# EasyEDA Pro project FPV_GROUND_STATION_SOURCE_FILE_PCB.epro

# Schematic Schematic1

## Sheets
1 POWER_BLK: Board Name: Board1; Create Date: 2026-05-17; Page Name: POWER_BLK; Project Name: JulyMonitor_uHAT; Schematic Name: Schematic1; Update Date: 2026-05-17; Company: EasyEDA.com; Page Size: A4; Version: V1.0
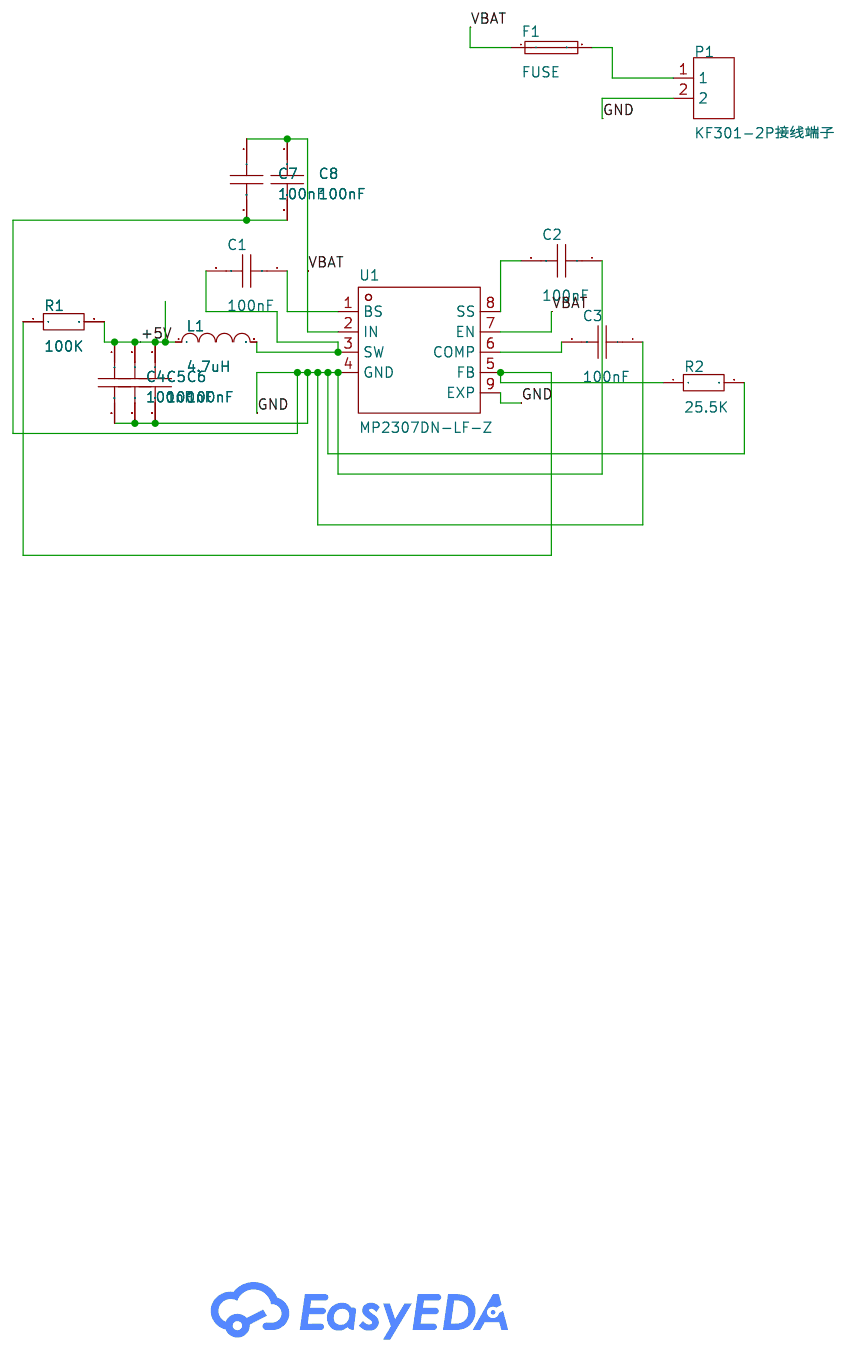
[diagram p0: POWER_BLK]
2 GPIO header + USB-A: Page Name: GPIO header + USB-A
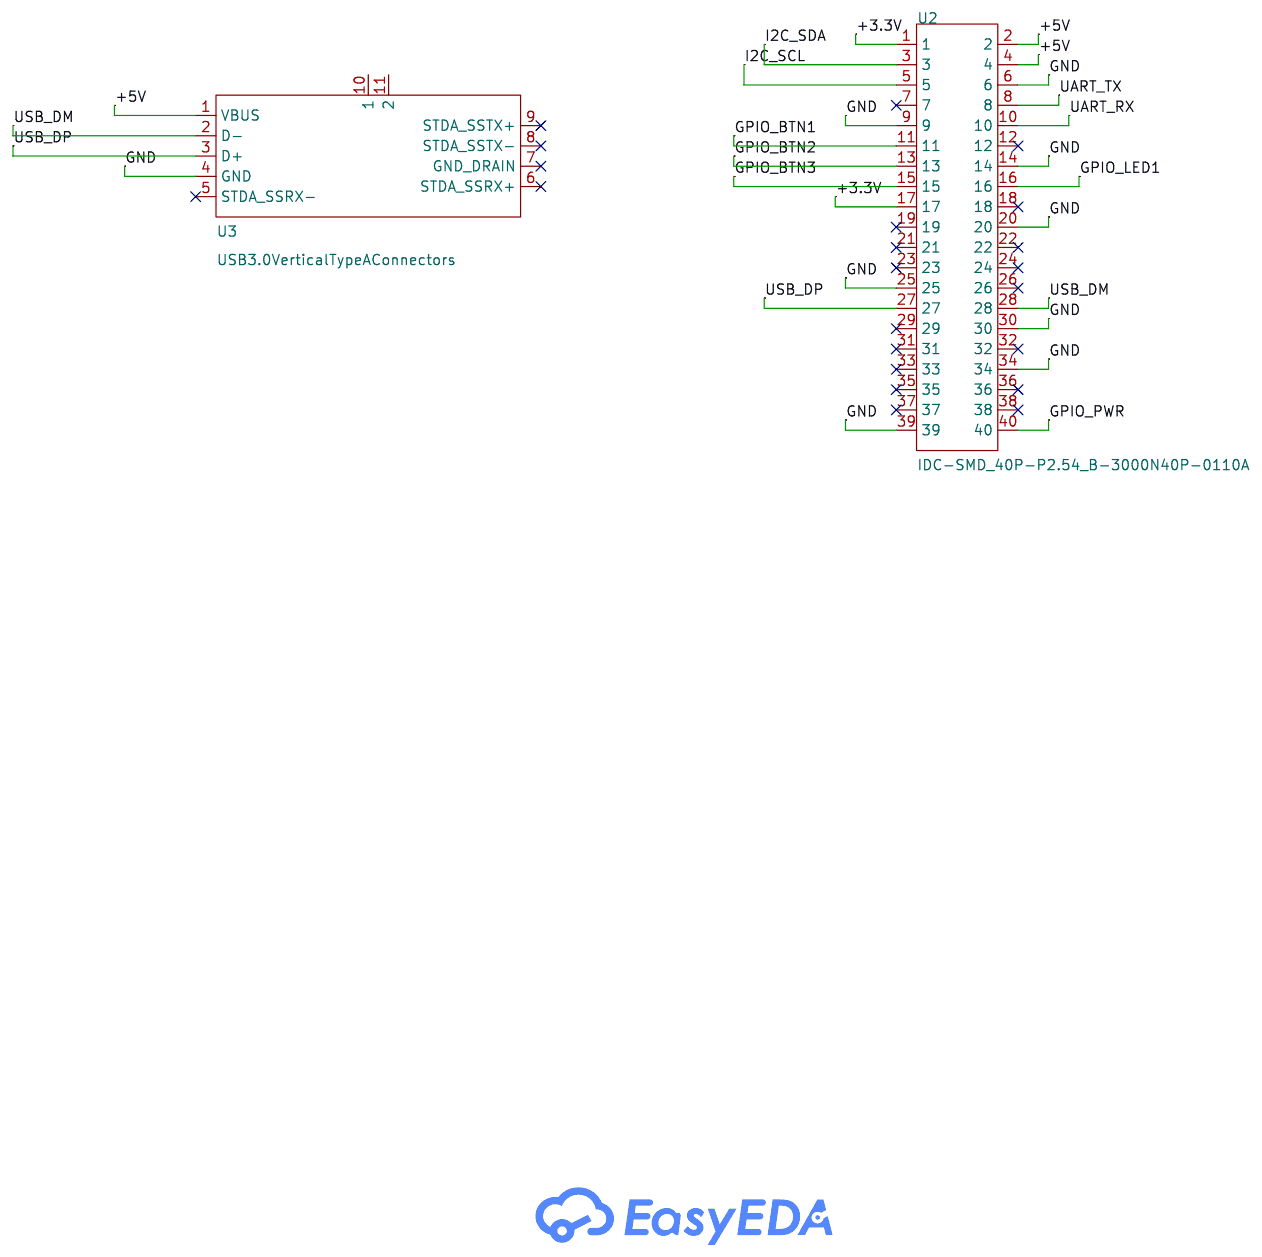
[diagram p1: GPIO header + USB-A]
3 LEDS AND OLED DISP: Page Name: LEDS AND OLED DISP
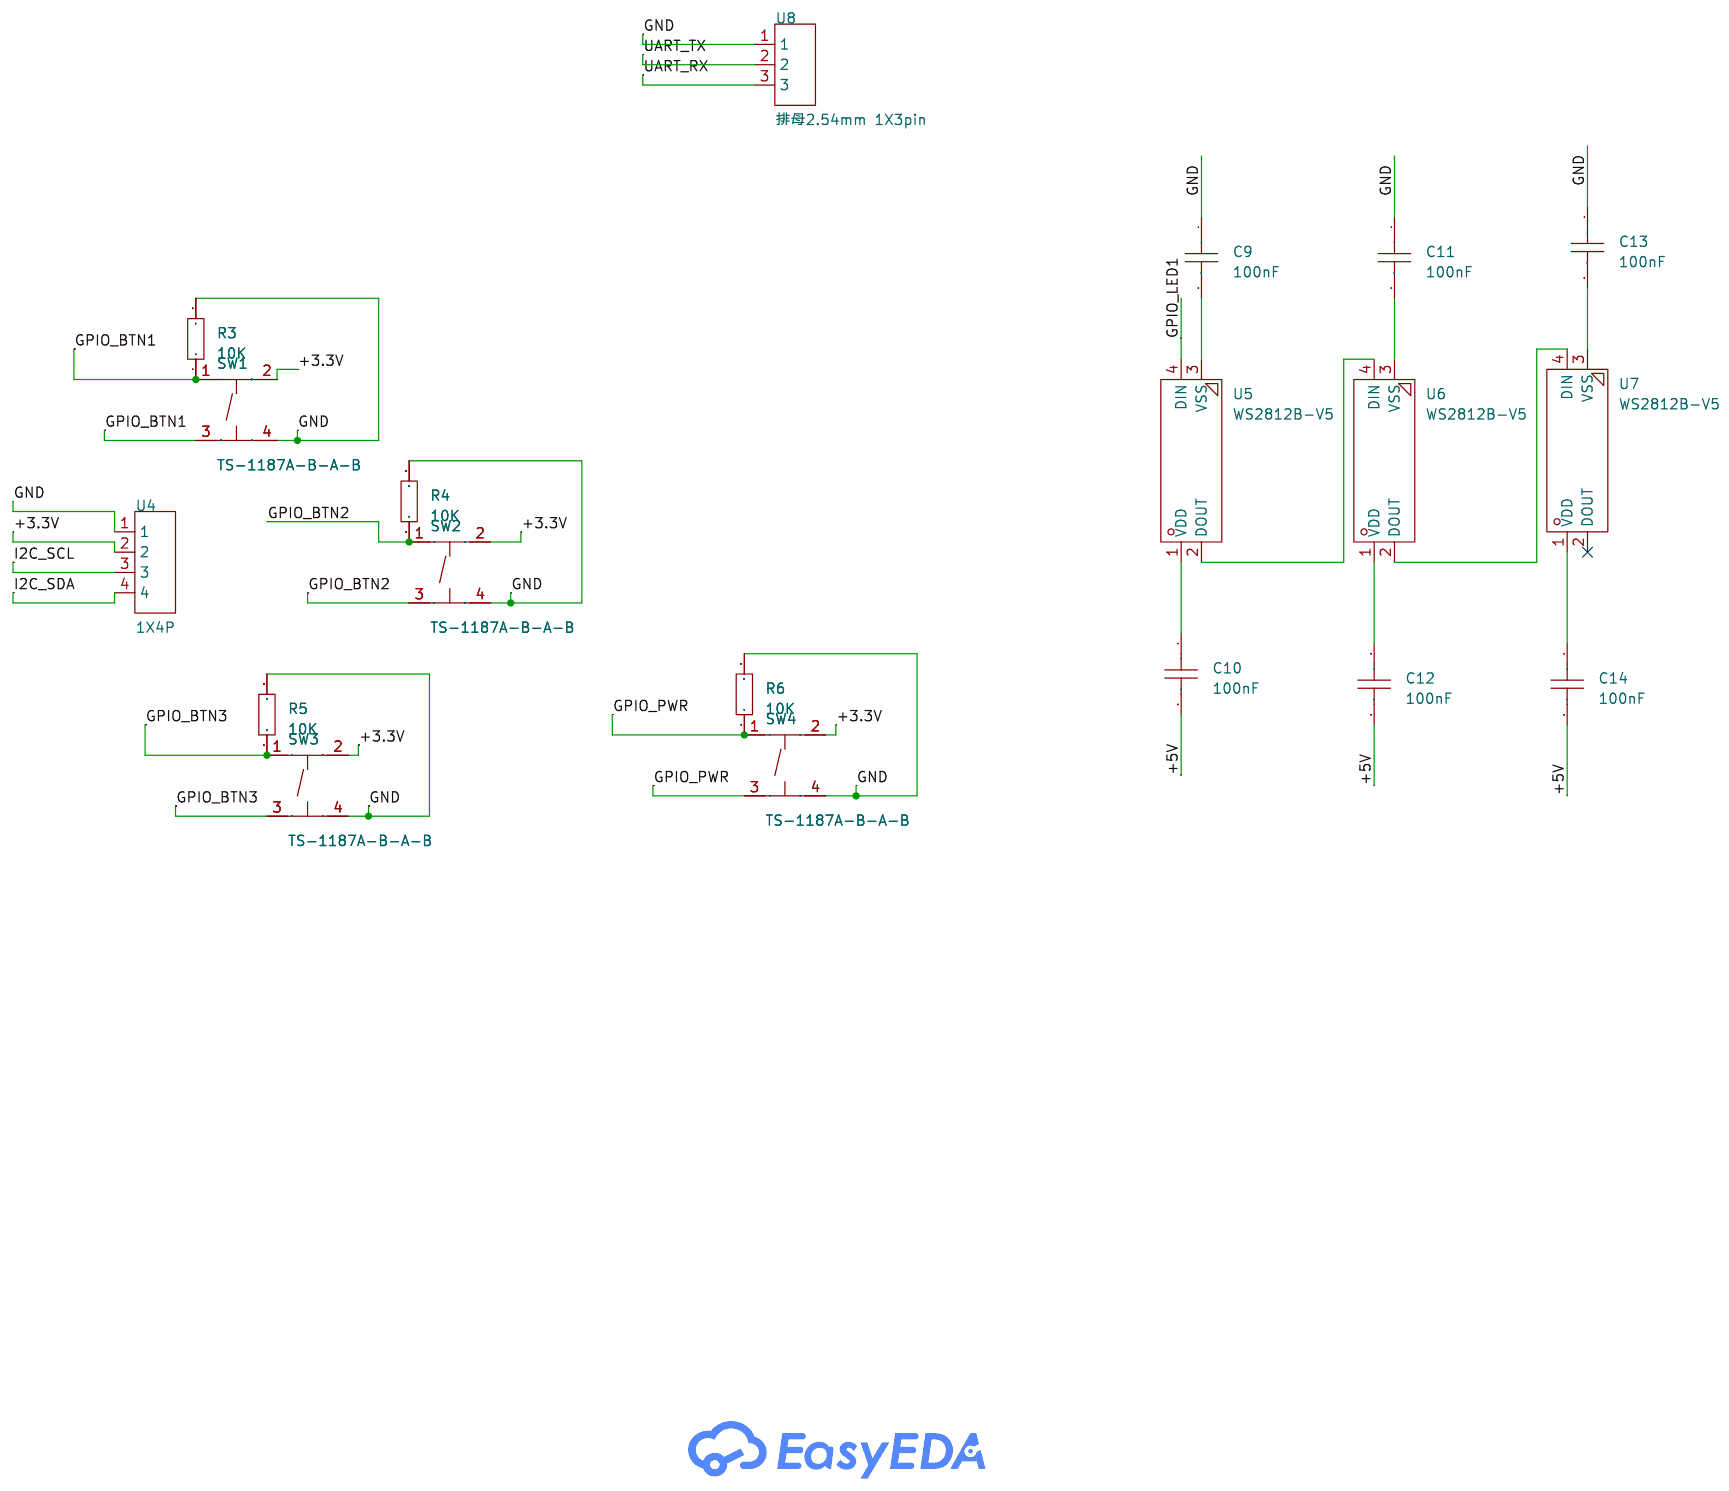
[diagram p2: LEDS AND OLED DISP]

## Parts
sheet GPIO header + USB-A
U2  IDC-SMD_40P-P2.54_B-3000N40P-0110A  [HDR-SMD_40P-P2.54-V-F-R2-C20-LS7.9]
U3  USB3.0VerticalTypeAConnectors  [USB-A-TH_C9900010398]
sheet LEDS AND OLED DISP
C9  100nF  [C0603]
C10  100nF  [C0603]
C11  100nF  [C0603]
C12  100nF  [C0603]
C13  100nF  [C0603]
C14  100nF  [C0603]
R3  10K  [R0603]
R4  10K  [R0603]
R5  10K  [R0603]
R6  10K  [R0603]
SW1  TS-1187A-B-A-B  [SW-SMD_4P-L5.1-W5.1-P3.70-LS6.5-TL_H1.5]
SW2  TS-1187A-B-A-B  [SW-SMD_4P-L5.1-W5.1-P3.70-LS6.5-TL_H1.5]
SW3  TS-1187A-B-A-B  [SW-SMD_4P-L5.1-W5.1-P3.70-LS6.5-TL_H1.5]
SW4  TS-1187A-B-A-B  [SW-SMD_4P-L5.1-W5.1-P3.70-LS6.5-TL_H1.5]
U4  1X4P  [CONN-TH_4P-P2.54_C9900022166]
U5  WS2812B-V5  [LED-SMD_4P-L5.0-W5.0-TL_WS2812B-B]
U6  WS2812B-V5  [LED-SMD_4P-L5.0-W5.0-TL_WS2812B-B]
U7  WS2812B-V5  [LED-SMD_4P-L5.0-W5.0-TL_WS2812B-B]
U8  排母2.54mm 1X3pin  [HDR-TH_3P-P2.54_CS-1165SDIG]
sheet POWER_BLK
C1  100nF  [C0603]
C2  100nF  [C0603]
C3  100nF  [C0603]
C4  100nF  [C0603]
C5  100nF  [C0603]
C6  100nF  [C0603]
C7  100nF  [C0603]
C8  100nF  [C0603]
F1  FUSE  [F1206]
L1  4.7uH  [L0603]
P1  KF301-2P接线端子  [CONN-TH_XY301V-A-5.0-2P]
R1  100K  [R0603]
R2  25.5K  [R0603]
U1  MP2307DN-LF-Z  [SOP-8_L4.9-W3.9-P1.27-LS6.0-BL-EP]

## Library data of the parts
U2 = IDC-SMD_40P-P2.54_B-3000N40P-0110A: Supplier Part: C9900016611; Supplier Footprint: 2.54mm2x20P; JLCPCB Part Class: Extended Part; Supplier: LCSC
U3 = USB3.0VerticalTypeAConnectors: Supplier Part: C9900010398; Supplier Footprint: USB3.0VerticalTypeA; JLCPCB Part Class: Extended Part; Supplier: LCSC
C1-C14 = CAP_0603: Supplier Footprint: 0603
R1-R6 = Res_0603: Supplier Footprint: 0603
SW1-SW4 = TS-1187A-B-A-B: Circuit:SPST Actuator Style:Round Button Operating Force:1.6N Mounting Type:Surface Mount,Vertical Length:5.1mm Width:5.1mm Switch Height:1.5mm with Bracket:Without Bracket Contact Current:50mA Voltage Rating:12V Actuator/Cap Color:Gold With Lamp:No Life:; LCSC Part Name: 5.1*5.1*1.5mm 立贴 轻触开关; Supplier Part: C318884; Manufacturer: XKB Connection(中国星坤); Supplier Footprint: SMD; JLCPCB Part Class: Basic Part; Datasheet: https://item.szlcsc.com/datasheet/TS-1187A-B-A-B/299976.html; Supplier: LCSC; Circuit: SPST; Actuator Style: Round Button; Operating Force: 1.6N; Mounting Type: Surface Mount,Vertical; Length: 5.1mm; Width: 5.1mm; Switch Height: 1.5mm; with Bracket: Without Bracket; Contact Current: 50mA; Voltage Rating: 12V; Actuator/Cap Color: Gold; With Lamp: No; Life: 100,000 Cycles; Operating Temperature: -30℃~+85℃
U4 = 1X4P: Supplier Part: C9900022166; Supplier Footprint: CONN-SMD-TH; JLCPCB Part Class: Extended Part; Supplier: LCSC
U5-U7 = WS2812B-V5: Supplier Part: C691873; Supplier Footprint: SMD,5x5mm; JLCPCB Part Class: Extended Part; Supplier: LCSC
U8 = 排母2.54mm 1X3pin: Supplier Part: C9900016709; JLCPCB Part Class: Extended Part; Supplier: LCSC
F1 = FUSE: Supplier Part: C9900021114; JLCPCB Part Class: Extended Part; Supplier: LCSC
L1 = L_0603
P1 = KF301-2P接线端子: Supplier Part: C9900016950; Supplier Footprint: CK301-2P; JLCPCB Part Class: Extended Part; Supplier: LCSC
U1 = MP2307DN-LF-Z: Function:Buck Voltage - Supply:4.75V~23V Voltage - Supply:4.75V~23V Output Voltage:925mV~20V Output Voltage:925mV~20V Output Current:3A Frequency - Switching:340kHz Frequency - Switching:340kHz Operating Temperature:-40℃~+85℃ Operating Temperature:-40℃~+8; LCSC Part Name: 3A，23V，340KHz同步整流降压转换器; Supplier Part: C18921; Manufacturer: MPS(芯源); Supplier Footprint: SOIC-8N-EP-150mil; JLCPCB Part Class: Extended Part; Datasheet: https://item.szlcsc.com/datasheet/MP2307DN-LF-Z/19624.html; Supplier: LCSC; Function: Buck; Voltage - Supply: 4.75V~23V; Output Voltage: 925mV~20V; Output Current: 3A; Frequency - Switching: 340kHz; Operating Temperature: -40℃~+85℃; Synchronous Rectifier: Yes; Number of Outputs: 1; Topology: Buck; Switch tube (built-in/external): Built-In; Output Type: Adjustable

## Nets
+3.3V: SW1.2(B) SW2.2(B) SW3.2(B) SW4.2(B) U2.1 U2.17 U4.2
+5V: C4.1 C5.1 C6.1 C10.2 C12.2 C14.2 L1.1 R1.2 U2.2 U2.4 U3.1(VBUS)
GND: C2.1 C3.1 C4.2 C5.2 C6.2 C7.2 C8.2 C9.1 C11.1 C13.1 P1.2 R2.2 R3.2 R4.2 R5.2 R6.2 SW1.4(D) SW2.4(D) SW3.4(D) SW4.4(D) U1.4(GND) U1.9(EXP) U2.6 U2.9 U2.14 U2.20 U2.25 U2.30 U2.34 U2.39 U3.4(GND) U4.1 U8.1
VBAT: C7.1 C8.1 F1.1 U1.2(IN) U1.7(EN)
GPIO_BTN1: R3.1 SW1.1(A) SW1.3(C) U2.11
GPIO_BTN2: R4.1 SW2.1(A) SW2.3(C) U2.13
GPIO_BTN3: R5.1 SW3.1(A) SW3.3(C) U2.15
GPIO_LED1: U2.16 U5.4(DIN)
GPIO_PWR: R6.1 SW4.1(A) SW4.3(C) U2.40
I2C_SCL: U2.5 U4.3
I2C_SDA: U2.3 U4.4
UART_RX: U2.10 U8.3
UART_TX: U2.8 U8.2
USB_DM: U2.28 U3.2(D-)
USB_DP: U2.27 U3.3(D+)
$1N198: F1.2 P1.1
$1N609: C1.2 L1.2 U1.3(SW)
$1N625: C1.1 U1.1(BS)
$1N643: C2.2 U1.8(SS)
$1N661: C3.2 U1.6(COMP)
$1N789: R1.1 R2.1 U1.5(FB)
$3N1279: C9.2 U5.3(VSS)
$3N1283: C11.2 U6.3(VSS)
$3N1287: C13.2 U7.3(VSS)
$3N1313: U5.2(DOUT) U6.4(DIN)
$3N1319: U6.2(DOUT) U7.4(DIN)
$3N1500: C10.1 U5.1(VDD)
$3N1509: C12.1 U6.1(VDD)
$3N1515: C14.1 U7.1(VDD)

Not connected (* = marked no-connect by the designer): U2 7* 12* 18* 19* 21* 22* 23* 24* 26* 29* 31* 32* 33* 35* 36* 37* 38*; U3 5(STDA_SSRX-)* 6(STDA_SSRX+)* 7(GND_DRAIN)* 8(STDA_SSTX-)* 9(STDA_SSTX+)* 10(1) 11(2); U7 2(DOUT)*

# Board PCB1
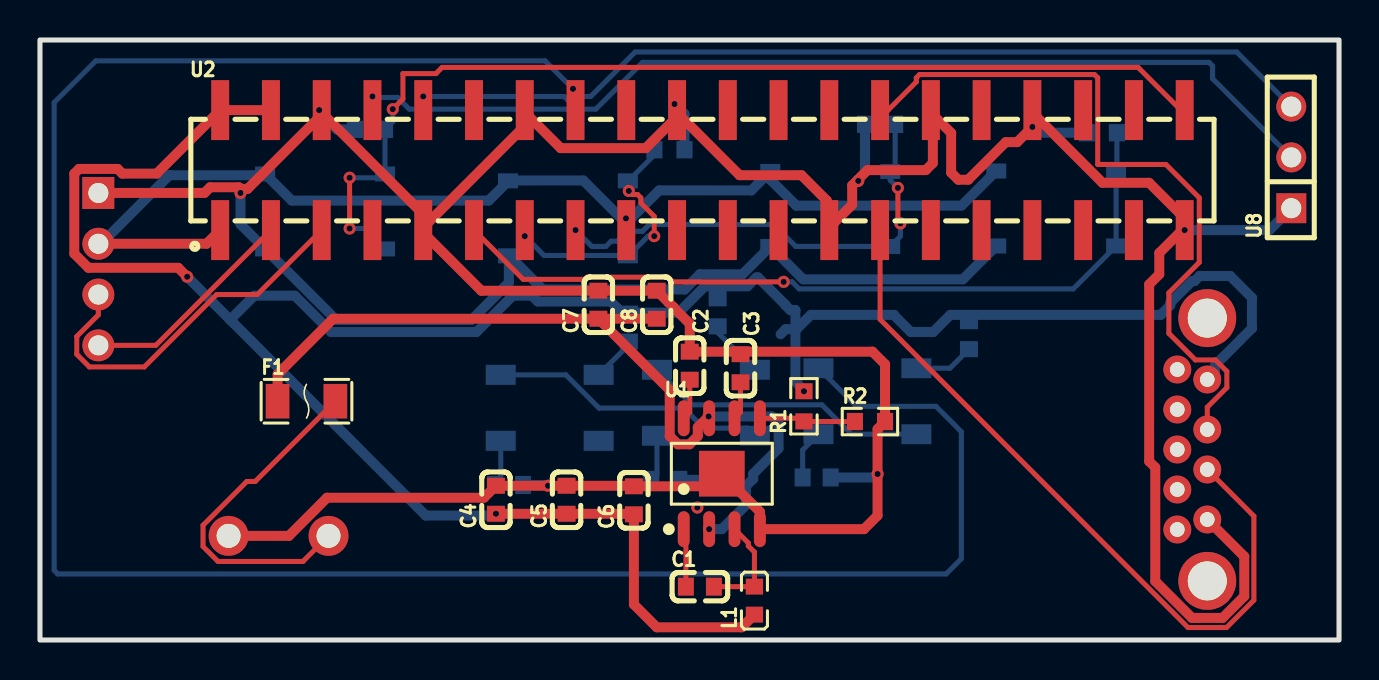
[diagram p3: board, top side]
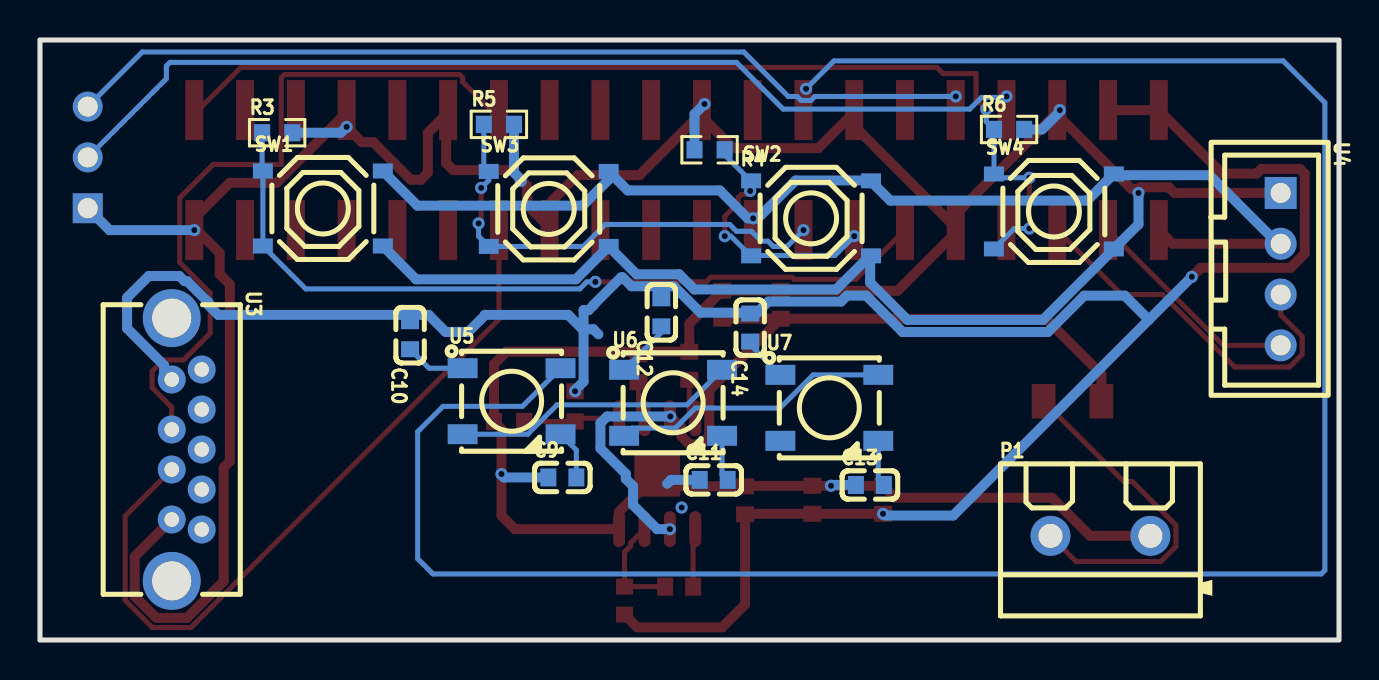
[diagram p4: board, bottom side, seen from below]

Outline 65 x 30 mm; copper layers: Top Layer, Bottom Layer. Coordinates in mm from the lower left corner of the outline.
Outline path: rectangle 0,30 65,0
Stack: Top Layer 0.035mm / Dielectric1 1.51mm FR4 er 4.5 / Bottom Layer 0.035mm

## Design rules (mm)
template: JLCPCB Capability(Two Layers Board)
spacing copperThickness1oz (default): track to track 0.102, other pairs 0.152 to 0.3
spacing copperThickness2oz: track to track 0.203, other pairs 0.152 to 0.3
track width copperThickness1oz (default): min 0.127, default 0.254, max 2.54
track width copperThickness2oz: min 0.203, default 0.254, max 2.54
differential pair differentialPair (default): width min 0.127, default 0.254, max 2.54; gap min 0.152, default 0.152
via viaSize (default): diameter min 0.5, default 0.61, max 10; hole min 0.3, default 0.305, max 6.3

## Placement (name value [footprint] x y rotation side)
C1  100nF  [C0603]  33.02 2.67 0 top
C2  100nF  [C0603]  32.51 13.72 270 top
C3  100nF  [C0603]  35.05 13.59 270 top
C4  100nF  [C0603]  22.82 7.01 90 top
C5  100nF  [C0603]  26.35 7.01 90 top
C6  100nF  [C0603]  29.72 6.98 90 top
C7  100nF  [C0603]  27.94 16.76 90 top
C8  100nF  [C0603]  30.86 16.76 90 top
C9  100nF  [C0603]  38.86 8.13 180 bottom
C10  100nF  [C0603]  46.48 15.24 90 bottom
C11  100nF  [C0603]  31.29 8.01 180 bottom
C12  100nF  [C0603]  33.91 16.38 90 bottom
C13  100nF  [C0603]  23.47 7.75 180 bottom
C14  100nF  [C0603]  29.46 15.62 90 bottom
F1  FUSE  [F1206]  13.33 11.94 0 top
L1  4.7uH  [L0603]  35.75 1.97 90 top
P1  KF301-2P接线端子  [CONN-TH_XY301V-A-5.0-2P]  11.94 5.21 180 bottom
R1  100K  [R0603]  38.23 11.68 90 top
R2  25.5K  [R0603]  41.53 10.92 0 top
R3  10K  [R0603]  53.13 25.36 180 bottom
R4  10K  [R0603]  31.5 24.51 0 bottom
R5  10K  [R0603]  42.04 25.78 180 bottom
R6  10K  [R0603]  16.51 25.53 180 bottom
SW1  TS-1187A-B-A-B  [SW-SMD_4P-L5.1-W5.1-P3.70-LS6.5-TL_H1.5]  50.85 21.58 180 bottom
SW2  TS-1187A-B-A-B  [SW-SMD_4P-L5.1-W5.1-P3.70-LS6.5-TL_H1.5]  26.42 21.08 180 bottom
SW3  TS-1187A-B-A-B  [SW-SMD_4P-L5.1-W5.1-P3.70-LS6.5-TL_H1.5]  39.54 21.55 180 bottom
SW4  TS-1187A-B-A-B  [SW-SMD_4P-L5.1-W5.1-P3.70-LS6.5-TL_H1.5]  14.27 21.43 180 bottom
U1  MP2307DN-LF-Z  [SOP-8_L4.9-W3.9-P1.27-LS6.0-BL-EP]  34.12 8.31 0 top
U2  IDC-SMD_40P-P2.54_B-3000N40P-0110A  [HDR-SMD_40P-P2.54-V-F-R2-C20-LS7.9]  33.15 23.49 0 top
U3  USB3.0VerticalTypeAConnectors  [USB-A-TH_C9900010398]  57.66 9.52 270 bottom
U4  1X4P  [CONN-TH_4P-P2.54_C9900022166]  2.92 18.54 270 bottom
U5  WS2812B-V5  [LED-SMD_4P-L5.0-W5.0-TL_WS2812B-B]  41.4 11.94 180 bottom
U6  WS2812B-V5  [LED-SMD_4P-L5.0-W5.0-TL_WS2812B-B]  33.32 11.86 180 bottom
U7  WS2812B-V5  [LED-SMD_4P-L5.0-W5.0-TL_WS2812B-B]  25.5 11.61 180 bottom
U8  排母2.54mm 1X3pin  [HDR-TH_3P-P2.54_CS-1165SDIG]  62.61 24.13 90 top

## Footprints (pads in the part's own frame, mm; a bottom-side part is the same pattern mirrored in y, then rotated)
C0603
  rect 0.8x0.9 smd: 1(-0.7,0) 2(0.7,0)
CONN-TH_4P-P2.54_C9900022166
  rect 1.6x1.6 hole 1: 1(-3.81,0)
  round 1.6 hole 1: 2(-1.27,0) 3(1.27,0) 4(3.81,0)
CONN-TH_XY301V-A-5.0-2P
  round 2 hole 1.2: 1(-2.5,0) 2(2.5,0)
F1206
  rect 1.19x1.728 smd: 1(-1.445,0) 2(1.445,0)
HDR-SMD_40P-P2.54-V-F-R2-C20-LS7.9
  rect 0.9x3 smd: 1(-24.13,-3) 2(-24.13,3) 3(-21.59,-3) 4(-21.59,3) 5(-19.05,-3) 6(-19.05,3) 7(-16.51,-3) 8(-16.51,3) 9(-13.97,-3) 10(-13.97,3) 11(-11.43,-3) 12(-11.43,3) 13(-8.89,-3) 14(-8.89,3) 15(-6.35,-3) 16(-6.35,3) 17(-3.81,-3) 18(-3.81,3) 19(-1.27,-3) 20(-1.27,3) 21(1.27,-3) 22(1.27,3) 23(3.81,-3) 24(3.81,3) 25(6.35,-3) 26(6.35,3) 27(8.89,-3) 28(8.89,3) 29(11.43,-3) 30(11.43,3) 31(13.97,-3) 32(13.97,3) 33(16.51,-3) 34(16.51,3) 35(19.05,-3) 36(19.05,3) 37(21.59,-3) 38(21.59,3) 39(24.13,-3) 40(24.13,3)
HDR-TH_3P-P2.54_CS-1165SDIG
  rect 1.5x1.5 hole 1: 1(-2.54,0)
  round 1.5 hole 1: 2(0,0) 3(2.54,0)
L0603
  rect 0.8x0.864 smd: 1(-0.7,0) 2(0.7,0)
LED-SMD_4P-L5.0-W5.0-TL_WS2812B-B
  rect 1.5x1 smd: 1(-2.45,1.65) 2(-2.45,-1.65) 3(2.45,-1.65) 4(2.45,1.65)
R0603
  rect 0.806x0.864 smd: 1(-0.753,0) 2(0.753,0)
SOP-8_L4.9-W3.9-P1.27-LS6.0-BL-EP
  oval 0.6x1.8 smd: 1(-1.905,-2.772) 2(-0.635,-2.772) 3(0.635,-2.772) 4(1.905,-2.772) 5(1.905,2.772) 6(0.635,2.772) 7(-0.635,2.772) 8(-1.905,2.772)
  rect 2.29x2.29 smd: 9(0,0)
SW-SMD_4P-L5.1-W5.1-P3.70-LS6.5-TL_H1.5
  rect 1x0.75 smd: 1(-3,1.875) 2(3,1.875) 3(-3,-1.875) 4(3,-1.875)
USB-A-TH_C9900010398
  round 1.4 hole 0.73: 1(-3.5,-0.75) 2(-1,-0.75) 3(1,-0.75) 4(3.5,-0.75) 5(4,0.75) 6(2,0.75) 7(0,0.75) 8(-2,0.75) 9(-4,0.75)
  round 2.9 hole 1.95: 10(-6.57,-0.75) 11(6.57,-0.75)

## Nets
As in the schematic.

Pads without a net: U2 7 12 18 19 21 22 23 24 26 29 31 32 33 35 36 37 38; U3 5 6 7 8 9 10 11; U7 2

## Via types
v1: diameter 0.61, hole 0.305, Top Layer to Bottom Layer, 28 vias

## Routing (per net, layer and track width the routed paths; a pad name or vN(x,y) marks a point on that pad's centre or on a via; arc(x,y) is an arc through that point)
+3.3V: length 57.1
  Top Layer w0.5: 9.02,20.49 8.33,19.81 U4.2
  Bottom Layer w0.5: SW1.2 46.11,21.72 37.85,21.72 36.54,23.02 SW3.2 35.59,22.48 30.98,22.48 29.58,21.08 29.08,21.08 27.19,22.98 23.46,22.98 22.45,21.97 12.6,21.97 SW4.2 11.21,23.24 6.48,23.24 3.05,19.81 U4.2
  vias: v1(29.32,21.08)
+5V: length 127.3
  Top Layer w0.5: v1(22.82,6.31) C5.1 29.69,6.31 C6.1 29.72,1.78 30.86,0.63 35.11,0.63 L1.1 ; v1(7.37,18.16) 6.92,18.61 2.42,18.61 1.72,19.31 1.72,23.32 1.95,23.55 3.89,23.55 4.12,23.32 5.84,23.32 9.02,26.49 U2.4
  Bottom Layer w0.5: 37.8,15.54 37.8,12.92 38.23,12.49 v1(38.23,12.44) ; 37.8,15.54 37.31,15.54 37.06,15.29 ; 37.8,15.54 37.85,15.54 38.57,16.26 42.73,16.26 42.73,16.24 43.57,15.4 44.7,15.4 45.55,16.26 56.08,16.26 56.56,16.73 56.56,16.86 57.64,17.95 57.77,17.95 58.02,18.2 59.56,18.2 60.64,17.12 60.64,15.58 58.79,13.73 58.79,13.41 U3.1 ; 37.8,15.54 37.8,16.48 37.79,16.49 37.55,16.49 37.31,16.73 37.31,16.75 35.93,18.13 35.85,18.13 35.4,17.69 33.27,17.69 31.95,16.37 29.09,16.37 28.86,16.6 28.86,16.62 28.55,16.92 24.91,16.92 24.62,17.22 23.66,17.22 21.84,15.4 14.57,15.4 12.75,17.22 10.72,17.22 9.52,16.01 ; 22.73,6.22 19.3,6.22 9.52,16.01 ; 9.52,16.01 v1(7.37,18.16)
GND: length 246.2
  Top Layer w0.254: v1(10.03,22.35) 10.03,22.56
  Top Layer w0.5: 19.05,20.49 24.13,25.57 24.13,26.49 24.15,26.49 26.05,24.59 30.31,24.59 31.97,26.25 31.99,26.25 35,23.24 38.1,23.24 39.37,21.97 39.37,20.49 40.64,21.77 40.64,22.73 41.4,23.49 44.32,23.49 44.68,23.85 44.68,26.27 ; 19.05,20.49 19.05,21.41 v1(13.97,26.49) 13.97,26.14 10.39,22.56 10.03,22.56 9.95,22.64 8.51,22.64 8.23,22.35 U4.1 ; 19.05,20.49 22.08,17.46 C7.2 C8.2 31.46,16.87 31.48,16.87 31.71,16.63 31.71,16.61 32.51,15.81 C2.1 34.92,14.42 35.05,14.29 35.18,14.42 41.66,14.42 42.28,13.79 R2.2 41.91,10.55 v1(41.91,8.3) 41.91,6.22 41.23,5.54 U1.4 36.02,6.41 34.62,7.81 U1.9 33.49,7.68 29.72,7.68 29.69,7.71 C5.2 v1(25.42,7.71) C4.2 22.22,7.11 14.36,7.11 12.46,5.21 P1.2 ; U3.4 60.26,4.17 60.26,2.19 59.17,1.1 57.64,1.1 55.81,2.94 55.81,8.63 55.5,8.93 55.5,17.78 56.01,18.29 56.01,19.35 57.15,20.49 57.15,21.21 55.5,22.86 53.17,22.86 49.53,26.49 49.53,25.53 48.89,24.89 48.32,24.89 46.45,23.01 45.95,23.01 45.59,23.37 45.59,25.35 44.68,26.27 ; 44.68,26.27 44.45,26.49
  Bottom Layer w0.5: v1(31.75,26.8) 32.25,26.3 R4.2 ; 13.97,26.42 14.86,25.53 R6.2 ; v1(10.03,22.35) 10.03,20.79 SW4.4 14.82,16 21.59,16 23.46,17.87 23.46,19.23 25.16,17.53 32.26,17.53 33.02,18.29 35.15,18.29 SW3.4 38.19,18.03 46.18,18.03 SW1.4 ; R3.2 49.95,25.36 v1(49.66,25.65) ; v1(57.28,20.49) 61.52,20.49 U8.1 ; C11.1 33.43,8.01 33.62,7.81 ; 41.91,8.25 41.78,8.13 C9.1 ; C13.1 25.4,7.75 ; 41.02,23.11 41.28,23.38 R5.2
  vias: v1(40.94,22.95)
VBAT: length 42.5
  Top Layer w0.5: C7.1 14.67,16.06 11.89,13.29 F1.1 ; C7.1 31.51,12.49 31.51,10.2 31.92,9.78 32.5,9.78 32.91,10.2 32.91,10.63 v1(33.46,11.18) ; C7.1 C8.1
  Bottom Layer w0.5: v1(33.48,5.54) 34.12,5.54 35.32,6.75 35.32,7.7 35.69,8.06 35.69,8.31 36.96,9.58 36.96,10.84 36.63,11.18 v1(33.46,11.18)
(no net):
  vias: v1(32.89,6.62)
GPIO_BTN1: length 40
  Top Layer w0.254: U2.11 24.18,18.03 27.27,18.03 27.37,18.14 31.43,18.14 31.66,17.91 v1(37.21,17.91)
  Bottom Layer w0.254: v1(37.21,17.91) 37.64,17.91 37.99,17.55 51.7,17.55 SW1.3 SW1.1 53.89,23.49 R3.1
GPIO_BTN2: length 12.8
  Top Layer w0.254: v1(29.46,22.45) 29.64,22.27 29.9,22.27 30.07,22.11 30.07,21.85 30.73,21.18 v1(30.73,20.19)
  Bottom Layer w0.254: v1(24.26,20.19) 25.22,19.23 29.46,19.23 30.43,20.19 v1(30.73,20.19) ; v1(29.46,22.45) 29.46,22.97 29.46,22.98 30.74,24.26 R4.1
GPIO_BTN3: length 23.6
  Top Layer w0.254: v1(42.93,22.61) 42.93,20.95 v1(43.05,20.83)
  Bottom Layer w0.254: v1(26.8,20.49) 27.61,19.68 28.31,19.68 28.58,19.94 28.9,19.94 29.4,20.43 30.15,20.43 30.49,20.78 36.71,20.78 37.81,19.68 SW3.3 43.05,20.19 v1(43.05,20.83) ; v1(42.93,22.61) 42.54,22.99 SW3.1 42.79,23.68 R5.1
GPIO_LED1: length 111.4
  Bottom Layer w0.254: v1(26.67,27.56) 25.27,28.96 2.79,28.96 0.71,26.87 0.71,3.48 0.89,3.3 45.34,3.3 46.1,4.06 46.1,10.41 44.83,11.68 40.86,11.68 U5.4
GPIO_PWR: length 52.1
  Top Layer w0.254: v1(15.49,23.11) v1(15.49,20.57) ; v1(17.65,26.54) 18.16,27.05 18.16,28.32 19.81,28.32 20.12,28.63 54.95,28.63 57.08,26.49 U2.40
  Bottom Layer w0.254: SW4.3 16.25,20.57 v1(15.49,20.57) ; v1(15.49,23.11) 17.08,23.11 SW4.1 17.26,23.31 R6.1 17.65,25.92 v1(17.65,26.54)
I2C_SCL: length 18.8
  Top Layer w0.254: U2.5 10.87,17.27 8.84,17.27 5.22,13.65 2.47,13.65 1.84,14.28 1.84,15.18 2.92,16.26 U4.3
I2C_SDA: length 11
  Top Layer w0.254: U4.4 5.79,14.73 U2.3
UART_RX: length 45.7
  Bottom Layer w0.254: v1(19.18,27.18) 26.22,27.18 26.43,26.97 26.91,26.97 27.11,27.18 27.56,27.18 29.78,29.4 59.88,29.4 U8.3
UART_TX: length 49.5
  Bottom Layer w0.254: U8.2 58.67,28.07 58.67,28.7 58.49,28.88 30.15,28.88 27.81,26.54 18.48,26.54 17.89,27.13 16.69,27.13 v1(16.64,27.18)
USB_DM: length 36.3
  Top Layer w0.254: U2.28 42.44,26.49 43.85,27.91 43.85,28.11 44.01,28.27 52.76,28.27 52.93,28.11 52.93,23.78 56.34,23.78 58.01,22.11 58.01,18.88 56.49,17.36 56.49,15.33 57.81,14 58.81,14 59.39,13.43 59.39,12.62 58.41,11.64 U3.2
USB_DP: length 37.6
  Top Layer w0.254: U3.3 60.74,6.19 60.74,1.99 59.37,0.62 57.44,0.62 42.04,16.03 U2.27
$1N198: length 17.4
  Top Layer w0.254: P1.1 13.16,3.93 8.91,3.93 8.16,4.68 8.16,5.74 10.35,7.93 10.77,7.93 F1.2
$1N609: length 5.3
  Top Layer w0.254: C1.2 35.75,2.67 L1.2 35.75,4.4 35.44,4.7 35.44,4.85 U1.3
$1N625: length 2.9
  Top Layer w0.254: C1.1 32.32,5.43 U1.1
$1N643: length 2.1
  Top Layer w0.254: 32.21,11.09 32.51,11.39 C2.2
$1N661: length 1.9
  Top Layer w0.254: C3.2 35.05,11.39 34.75,11.09
$1N789: length 4.8
  Top Layer w0.254: 36.02,11.09 38.07,11.09 R1.1 38.24,10.92 R2.1
$3N1279: length 2.5
  Bottom Layer w0.254: U5.3 38.16,9.5 C9.2
$3N1283: length 2.3
  Bottom Layer w0.254: C11.2 30.87,8.29 U6.3
$3N1287: length 2.3
  Bottom Layer w0.254: C13.2 23.05,8.03 U7.3
$3N1313: length 14.3
  Bottom Layer w0.254: U5.2 40.6,10.29 39.12,11.76 32.62,11.76 U6.4
$3N1319: length 14
  Bottom Layer w0.254: U7.4 26.31,13.26 27.97,11.6 32.21,11.6 33.22,10.59 35.39,10.59 U6.2
$3N1500: length 3
  Bottom Layer w0.254: U5.1 45.53,13.59 C10.1
$3N1509: length 2.9
  Bottom Layer w0.254: C12.1 33.91,15.37 U6.1
$3N1515: length 2.3
  Bottom Layer w0.254: U7.1 29.46,14.77 C14.1
